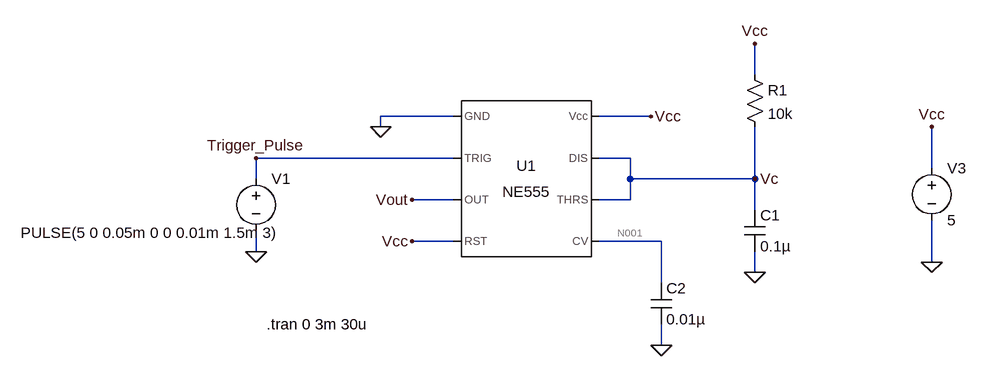
[diagram p0: schematic 555 Timer IC.asc]
555 Timer IC.asc, the LTspice schematic file:
Version 4
SHEET 1 1548 680
WIRE 576 16 576 -32
WIRE 112 80 0 80
WIRE 416 80 336 80
WIRE 0 96 0 80
WIRE 112 144 -192 144
WIRE 384 144 336 144
WIRE 848 160 848 96
WIRE -192 176 -192 144
WIRE 384 176 384 144
WIRE 576 176 576 96
WIRE 576 176 384 176
WIRE 112 208 48 208
WIRE 384 208 384 176
WIRE 384 208 336 208
WIRE 576 224 576 176
WIRE 112 272 48 272
WIRE 432 272 336 272
WIRE -192 288 -192 256
WIRE 848 304 848 240
WIRE 576 320 576 288
WIRE 432 336 432 272
WIRE 432 432 432 400
FLAG 0 96 0
FLAG -192 288 0
FLAG 416 80 Vcc
FLAG 48 272 Vcc
FLAG 48 208 Vout
FLAG 576 320 0
FLAG 432 432 0
FLAG 848 304 0
FLAG 848 96 Vcc
FLAG 576 -32 Vcc
FLAG -192 144 Trigger_Pulse
FLAG 576 176 Vc
SYMBOL Misc\\NE555 224 176 R0
SYMATTR InstName U1
SYMBOL voltage -192 160 R0
WINDOW 3 -362 99 Left 2
WINDOW 123 0 0 Left 0
WINDOW 39 0 0 Left 0
SYMATTR Value PULSE(5 0 0.05m 0 0 0.01m 1.5m 3)
SYMATTR InstName V1
SYMBOL res 560 0 R0
SYMATTR InstName R1
SYMATTR Value 10k
SYMBOL cap 560 224 R0
SYMATTR InstName C1
SYMATTR Value 0.1µ
SYMBOL voltage 848 144 R0
SYMATTR InstName V3
SYMATTR Value 5
SYMBOL cap 416 336 R0
SYMATTR InstName C2
SYMATTR Value 0.01µ
TEXT -176 400 Left 2 !.tran 0 3m 30u

The netlist it stands for:
* 555 Timer IC.asc
XU1 0 Trigger_Pulse Vout Vcc N001 Vc Vc Vcc NE555  ; pins GND TRIG OUT RST CV THRS DIS Vcc
V1 Trigger_Pulse 0 PULSE(5 0 0.05m 0 0 0.01m 1.5m 3)
R1 Vcc Vc 10k
C1 Vc 0 0.1µ
V3 Vcc 0 5
C2 N001 0 0.01µ
.tran 0 3m 30u
.lib NE555.sub
.backanno
.end

* Results of the author's LTspice run, read from the files saved beside the schematic
* Operating Point, zero values left out:
*   V(trigger_pulse) = 5 V
*   V(n001) = 3.333 V
*   V(vcc) = 5 V
*   V(vc) = 5 V
*   V(vout) = 5 V
*   I(R1) = 11.67 nA
*   I(V3) = -1.611 mA
*   I(V1) = -5 nA
*   Ix(u1:1) = -1.611 mA
*   Ix(u1:2) = 5 nA
*   Ix(u1:4) = 22.67 µA
*   Ix(u1:6) = 5 nA
*   Ix(u1:7) = 6.672 nA
*   Ix(u1:8) = 1.588 mA
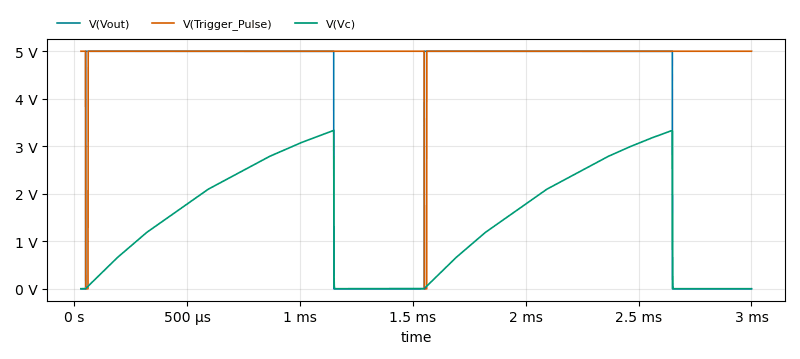
[diagram p1: Transient Analysis of 555 Timer IC.asc, plotted from the saved traces]
* Transient Analysis, 1 run:
*   V(Vout): min 30 µV, max 5 V, average 3.699 V, rms 4.301 V, last 30 µV
*   V(Trigger_Pulse): min 0 V, max 5 V, average 4.963 V, rms 4.981 V, last 5 V
*   V(Vc): min 2.998 mV, max 3.335 V, average 1.45 V, rms 1.887 V, last 2.998 mV